# EAGLE design current-sense-v1.0 (EAGLE 9.5.2)

## Sheet 1 of 3: Motor Driver
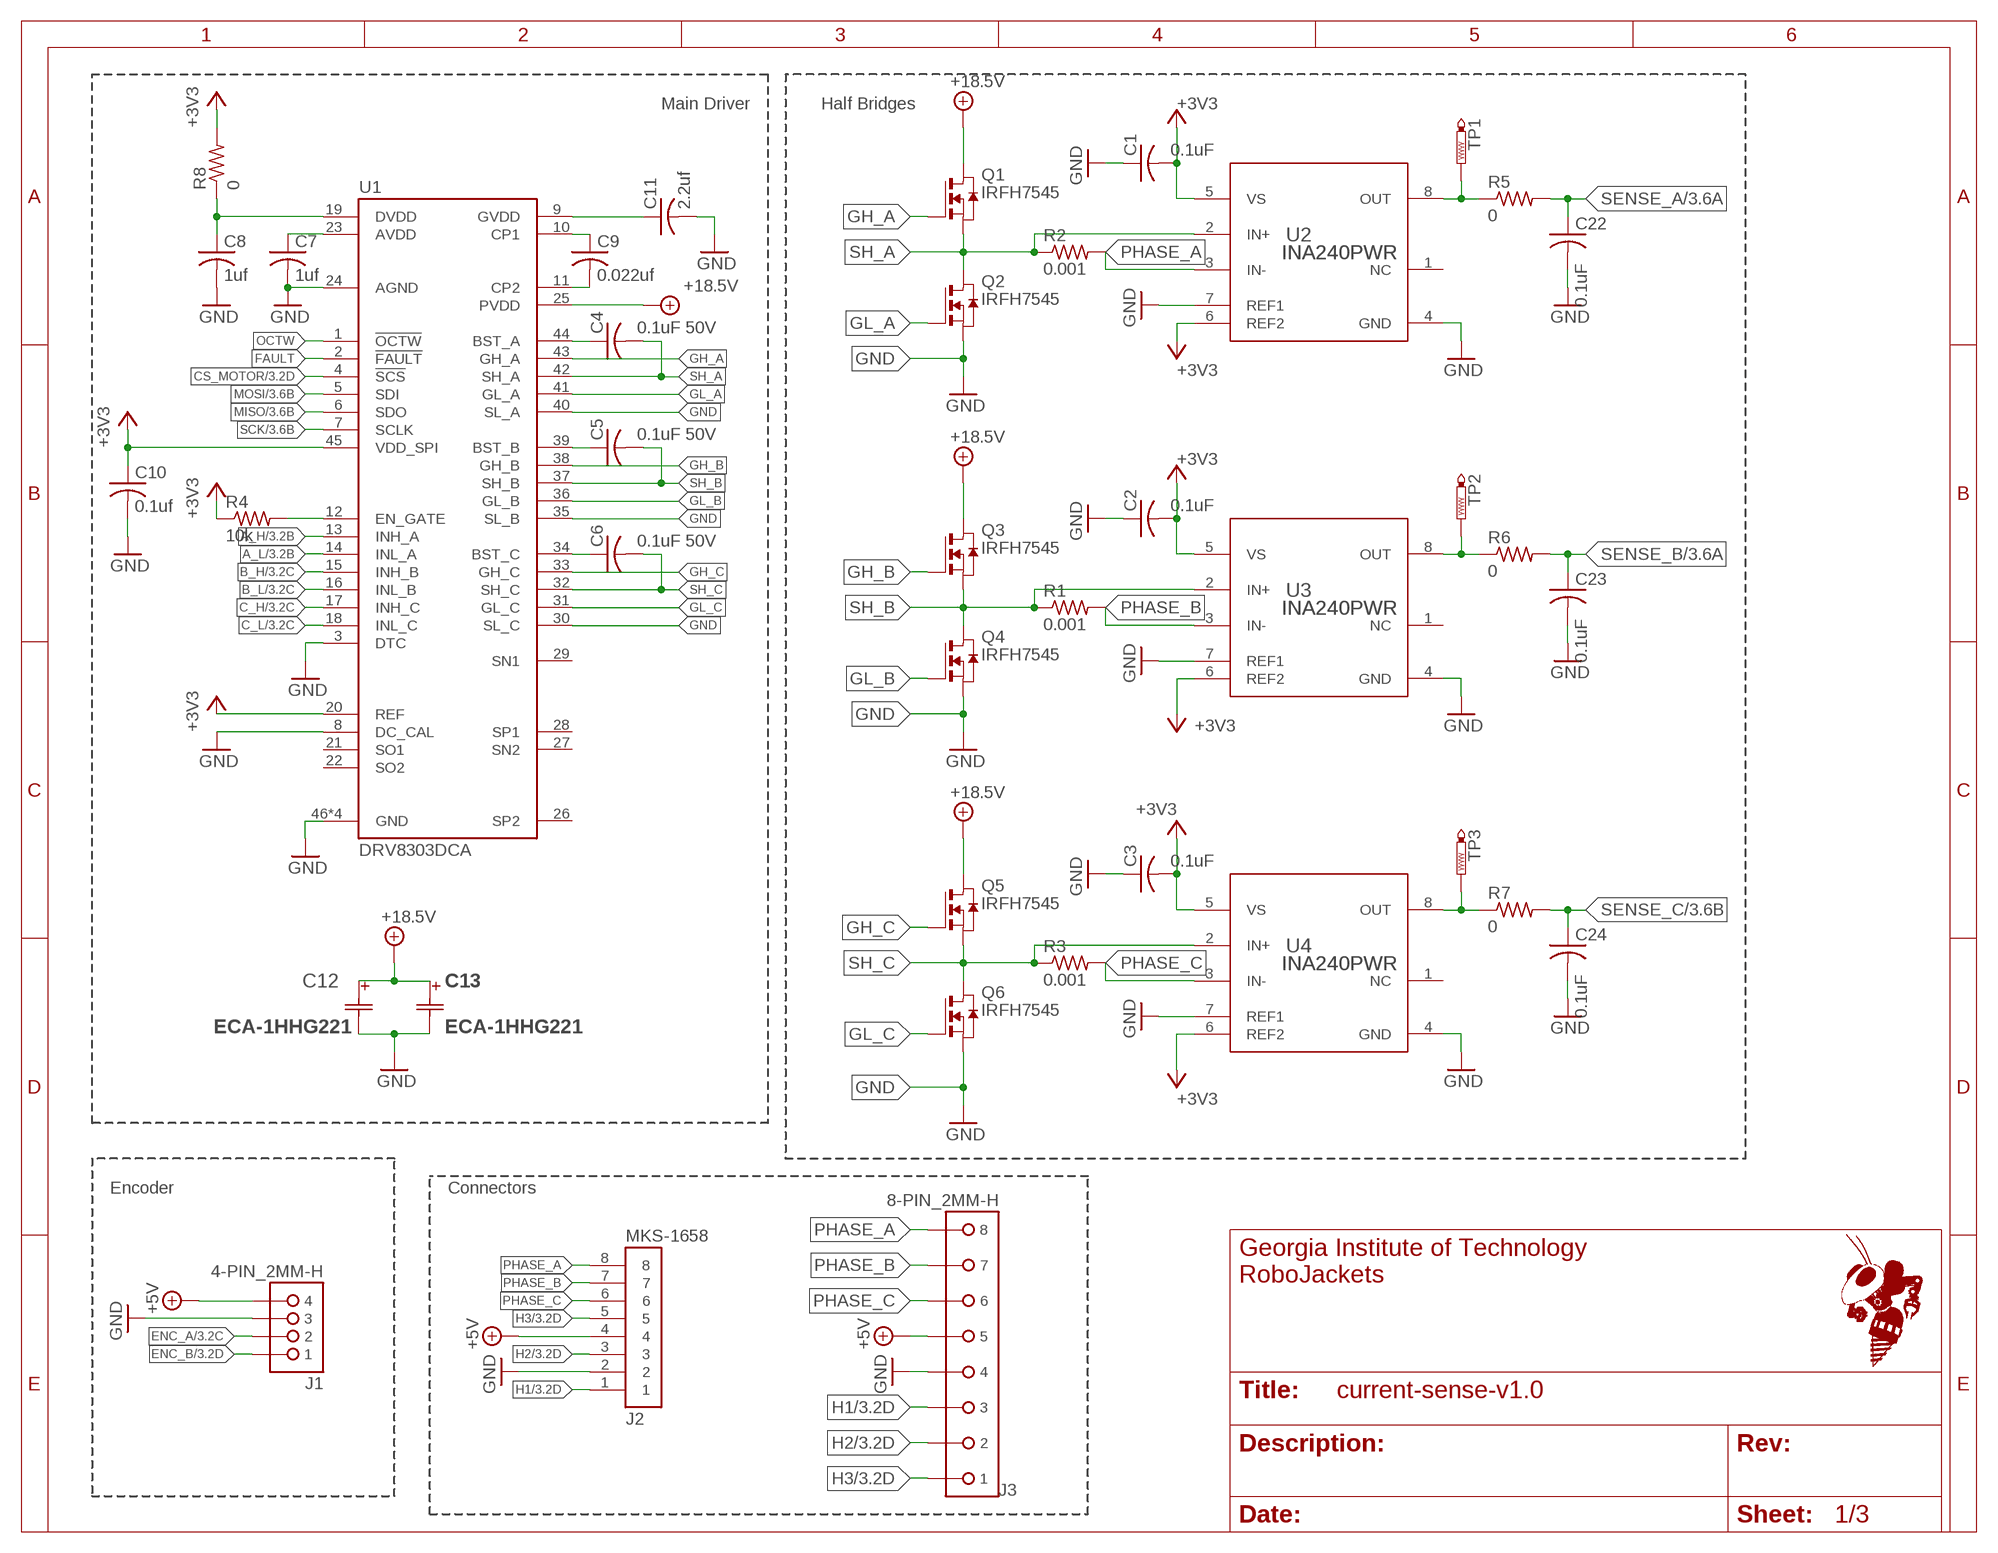
[diagram p0: schematic, sheet 1]

### Parts
C1  0.1uF  C-USC0603  [C0603]
C2  0.1uF  C-USC0603  [C0603]
C3  0.1uF  C-USC0603  [C0603]
C4  0.1uF 50V  C-USC0603  [C0603]
C5  0.1uF 50V  C-USC0603  [C0603]
C6  0.1uF 50V  C-USC0603  [C0603]
C7  1uf  C-USC0603  [C0603]
C8  1uf  C-USC0603  [C0603]
C9  0.022uf  C-USC0603  [C0603]
C10  0.1uf  C-USC0603  [C0603]
C11  2.2uf  C-USC0603  [C0603]
C12  ECA-1HHG221  [CAP_PAN_10X12.5]
C13  ECA-1HHG221  [CAP_PAN_10X12.5]
C22  0.1uF  C-USC0603  [C0603]
C23  0.1uF  C-USC0603  [C0603]
C24  0.1uF  C-USC0603  [C0603]
J1  4-PIN_2MM-H  [2MM-4-H]
J2  MKS-1658  [MKS-1658]
J3  8-PIN_2MM-H  [2MM-8-H]
Q1  IRFH7545  [PQFN_5X6_E]
Q2  IRFH7545  [PQFN_5X6_E]
Q3  IRFH7545  [PQFN_5X6_E]
Q4  IRFH7545  [PQFN_5X6_E]
Q5  IRFH7545  [PQFN_5X6_E]
Q6  IRFH7545  [PQFN_5X6_E]
R1  0.001  R-US_R2512  [R2512]
R2  0.001  R-US_R2512  [R2512]
R3  0.001  R-US_R2512  [R2512]
R4  10k  R-US_R0603  [R0603]
R5  0  R-US_R0603  [R0603]
R6  0  R-US_R0603  [R0603]
R7  0  R-US_R0603  [R0603]
R8  0  R-US_R0603  [R0603]
TP1  PTR1PAD1-13  [P1-13]
TP2  PTR1PAD1-13  [P1-13]
TP3  PTR1PAD1-13  [P1-13]
U1  DRV8303DCA  [TSSOP-48_PAD]
U2  INA240PWR  [PW0008A_N]
U3  INA240PWR  [PW0008A_N]
U4  INA240PWR  [PW0008A_N]

### Nets
+3V3: C1.2 C2.2 C3.2 C10.1 R4.1 R8.2 U1.20(REF) U1.45(VDD_SPI) U2.5(VS) U2.6(REF2) U3.5(VS) U3.6(REF2) U4.5(VS) U4.6(REF2) ; also sheet 2,3
+5V: J1.4 J2.4 J3.5 ; also sheet 2
+18.5V: C12.1 C13.1 Q1.5678(D) Q3.5678(D) Q5.5678(D) U1.25(PVDD) ; also sheet 2
A_H: U1.13(INH_A) ; also sheet 3
A_L: U1.14(INL_A) ; also sheet 3
AVDD: C7.1 U1.23(AVDD)
B_H: U1.15(INH_B) ; also sheet 3
B_L: U1.16(INL_B) ; also sheet 3
BST_A: C4.1 U1.44(BST_A)
BST_B: C5.1 U1.39(BST_B)
BST_C: C6.1 U1.34(BST_C)
C_H: U1.17(INH_C) ; also sheet 3
C_L: U1.18(INL_C) ; also sheet 3
CP1: C9.1 U1.10(CP1)
CP2: C9.2 U1.11(CP2)
CS_MOTOR: U1.4(!SCS) ; also sheet 3
DVDD: C8.1 R8.1 U1.19(DVDD)
EN_GATE: R4.2 U1.12(EN_GATE)
ENC_A: J1.2 ; also sheet 3
ENC_B: J1.1 ; also sheet 3
FAULT: U1.2(!FAULT)
GH_A: Q1.4(G) U1.43(GH_A)
GH_B: Q3.4(G) U1.38(GH_B)
GH_C: Q5.4(G) U1.33(GH_C)
GL_A: Q2.4(G) U1.41(GL_A)
GL_B: Q4.4(G) U1.36(GL_B)
GL_C: Q6.4(G) U1.31(GL_C)
GND: C1.1 C2.1 C3.1 C7.2 C8.2 C10.2 C11.2 C12.2 C13.2 C22.2 C23.2 C24.2 J1.3 J2.2 J3.4 Q2.1(S) Q2.2(S) Q2.3(S) Q4.1(S) Q4.2(S) Q4.3(S) Q6.1(S) Q6.2(S) Q6.3(S) U1.3(DTC) U1.8(DC_CAL) U1.24(AGND) U1.30(SL_C) U1.35(SL_B) U1.40(SL_A) U1.46(GND) U1.47(GND) U1.48(GND) U1.PAD(GND) U2.4(GND) U2.7(REF1) U3.4(GND) U3.7(REF1) U4.4(GND) U4.7(REF1) ; also sheet 2,3
GVDD: C11.1 U1.9(GVDD)
H1: J2.1 J3.3 ; also sheet 3
H2: J2.3 J3.2 ; also sheet 3
H3: J2.5 J3.1 ; also sheet 3
MISO: U1.6(SDO) ; also sheet 3
MOSI: U1.5(SDI) ; also sheet 3
OCTW: U1.1(!OCTW)
OUT_A: R5.1 TP1.TP U2.8(OUT)
OUT_B: R6.1 TP2.TP U3.8(OUT)
OUT_C: R7.1 TP3.TP U4.8(OUT)
PHASE_A: J2.8 J3.8 R2.2 U2.3(IN-)
PHASE_B: J2.7 J3.7 R1.2 U3.3(IN-)
PHASE_C: J2.6 J3.6 R3.2 U4.3(IN-)
SCK: U1.7(SCLK) ; also sheet 3
SENSE_A: C22.1 R5.2 ; also sheet 3
SENSE_B: C23.1 R6.2 ; also sheet 3
SENSE_C: C24.1 R7.2 ; also sheet 3
SH_A: C4.2 Q1.1(S) Q1.2(S) Q1.3(S) Q2.5678(D) R2.1 U1.42(SH_A) U2.2(IN+)
SH_B: C5.2 Q3.1(S) Q3.2(S) Q3.3(S) Q4.5678(D) R1.1 U1.37(SH_B) U3.2(IN+)
SH_C: C6.2 Q5.1(S) Q5.2(S) Q5.3(S) Q6.5678(D) R3.1 U1.32(SH_C) U4.2(IN+)
Unconnected: U1.21(SO1) U1.22(SO2) U1.26(SP2) U1.27(SN2) U1.28(SP1) U1.29(SN1) U2.1(NC) U3.1(NC) U4.1(NC)

### Notes on the sheet
- Main Driver | Half Bridges
- Encoder | Connectors

## Sheet 2 of 3: Power
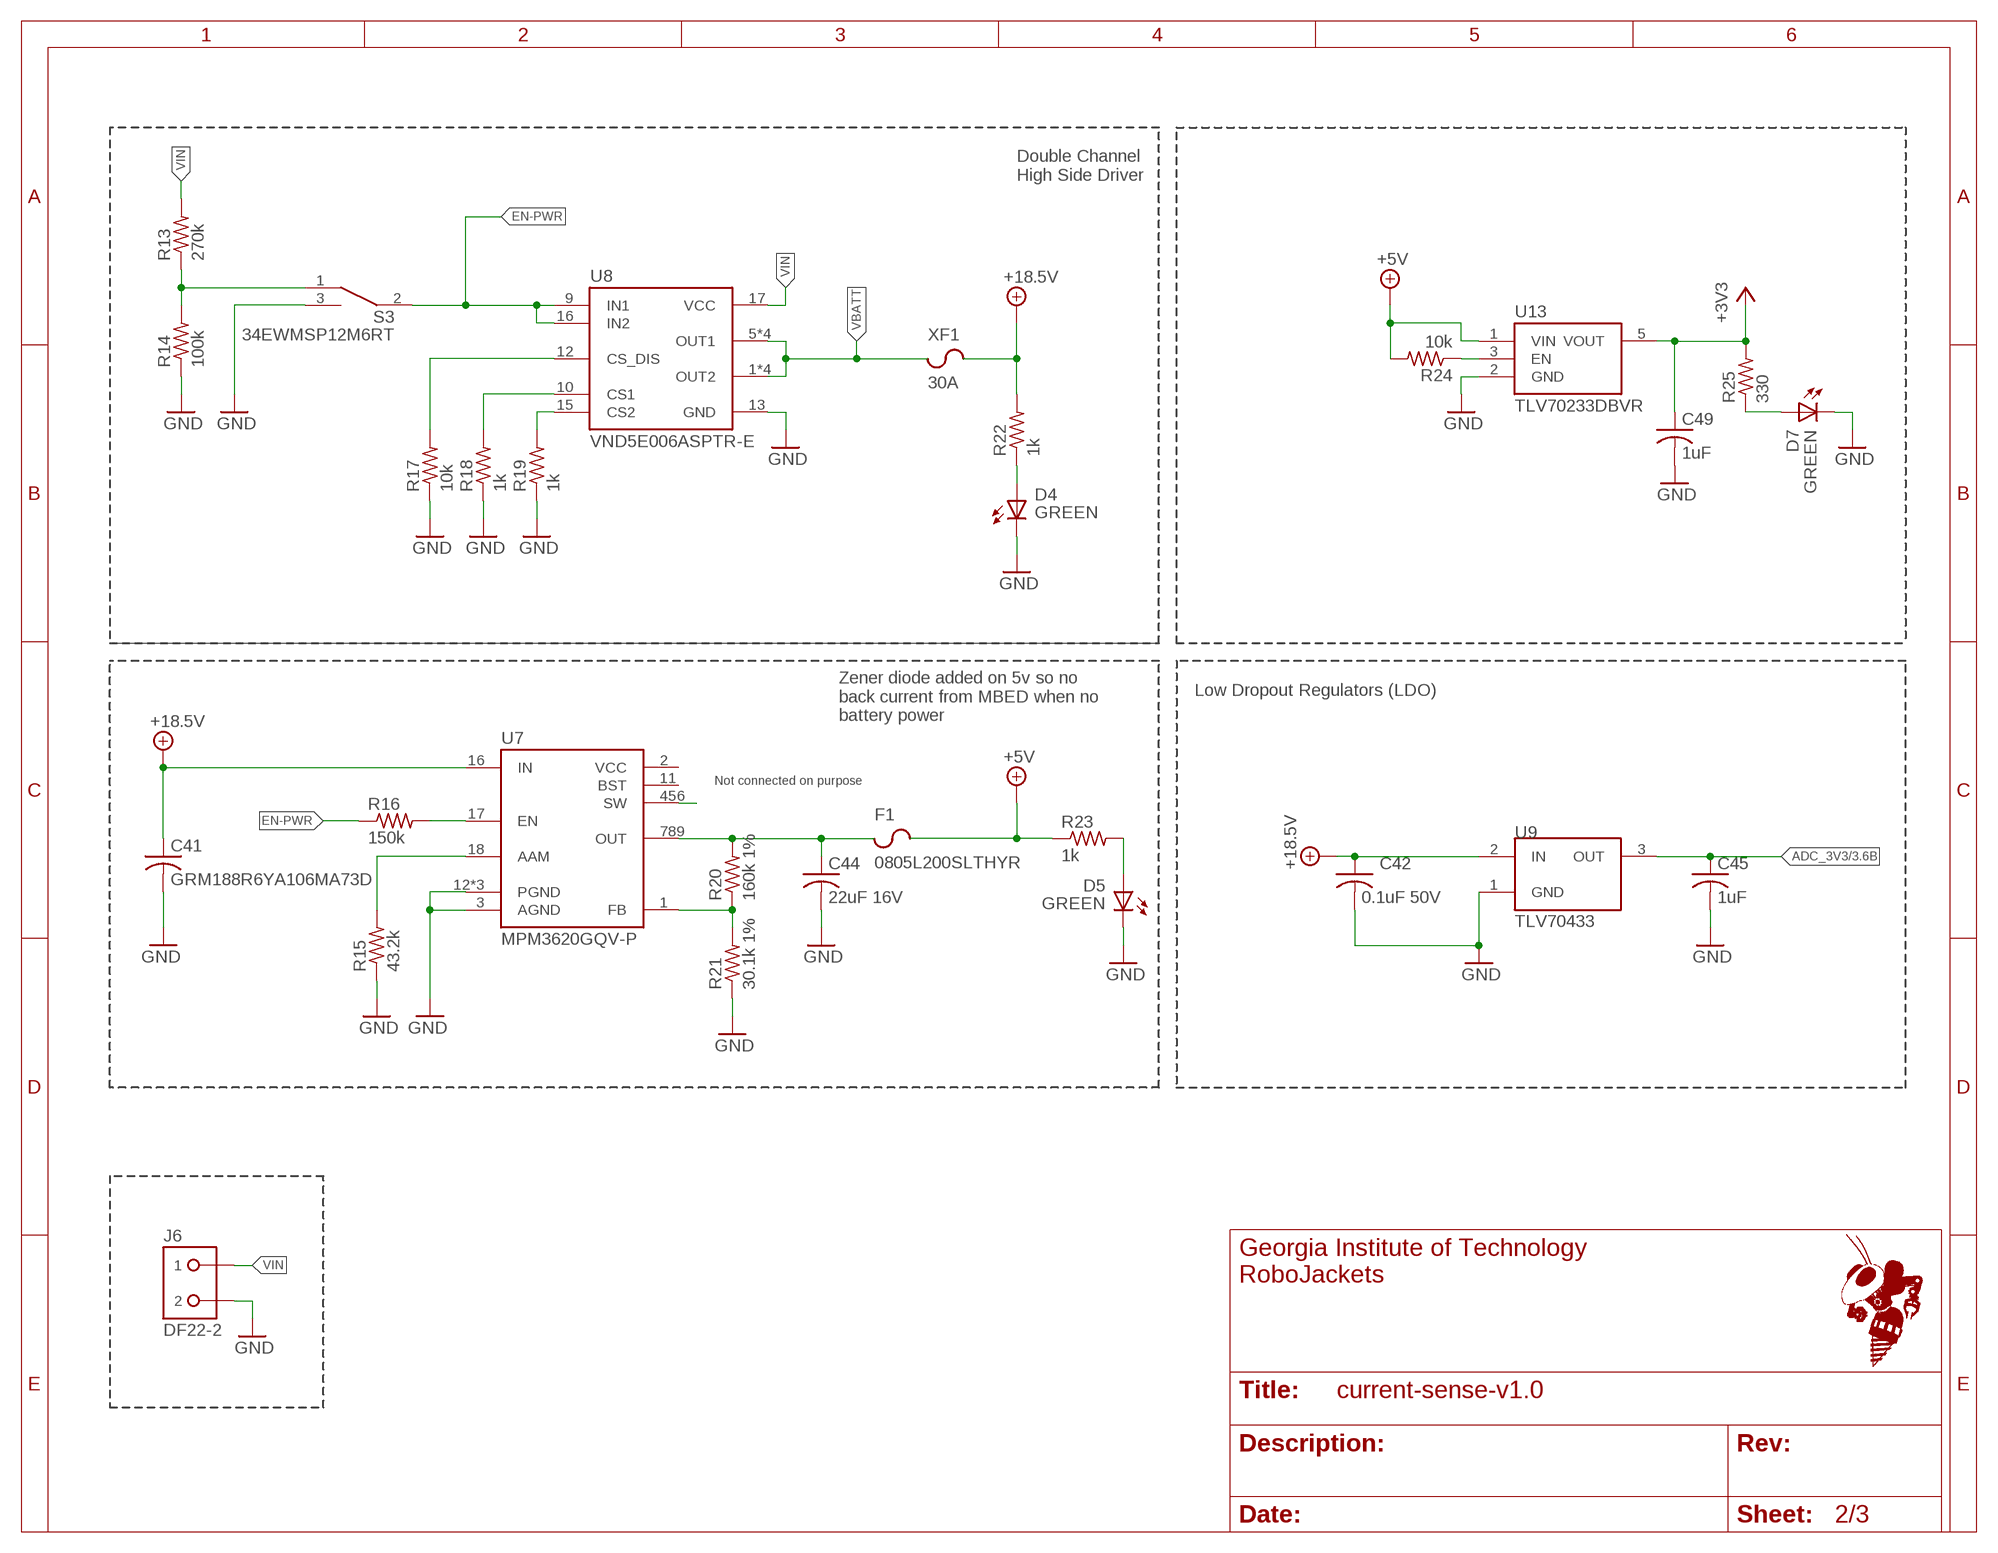
[diagram p1: schematic, sheet 2]

### Parts
C41  GRM188R6YA106MA73D  C-USC0603  [C0603]
C42  0.1uF 50V  C-USC0603  [C0603]
C44  22uF 16V  C-USC0805  [C0805]
C45  1uF  C-USC0603  [C0603]
C49  1uF  C-USC0603  [C0603]
D4  GREEN  LED-SMD-GREEN  [CHIP-LED0603]
D5  GREEN  LED-SMD-GREEN  [CHIP-LED0603]
D7  GREEN  LED-SMD-GREEN  [CHIP-LED0603]
F1  0805L200SLTHYR  CHIP_FUSE0805  [FUSC2113X75]
J6  DF22-2  [DF22-2-H]
R13  270k  R-US_R0603  [R0603]
R14  100k  R-US_R0603  [R0603]
R15  43.2k  R-US_R0603  [R0603]
R16  150k  R-US_R0603  [R0603]
R17  10k  R-US_R0603  [R0603]
R18  1k  R-US_R0603  [R0603]
R19  1k  R-US_R0603  [R0603]
R20  160k 1%  R-US_R0603  [R0603]
R21  30.1k 1%  R-US_R0603  [R0603]
R22  1k  R-US_R0603  [R0603]
R23  1k  R-US_R0603  [R0603]
R24  10k  R-US_R0603  [R0603]
R25  330  R-US_R0603  [R0603]
S3  34EWMSP12M6RT  [34EWMSP12M6RT]
U7  MPM3620GQV-P  [MPM3620GQV-P]
U8  VND5E006ASPTR-E  [POWERSO-16]
U9  TLV70433  [SOT-23-5]
U13  TLV70233DBVR  [SOT-23-5]
XF1  30A  3557-2  [3557-2]

### Nets
3.3V-EN: R24.1 U13.3(EN)
3V3-LED: D7.A R25.1
5V-LED: D5.A R23.2
18.5V-LED: D4.A R22.1
+3V3: C49.1 R25.2 U13.5(VOUT) ; also sheet 1,3
+5V: F1.2 R23.1 R24.2 U13.1(VIN) ; also sheet 1
+5V-FUSE: C44.1 F1.1 R20.2 U7.789(OUT)
+18.5V: C41.1 C42.1 R22.2 U7.16(IN) U9.2(IN) XF1.3 XF1.4 ; also sheet 1
AAM: R15.2 U7.18(AAM)
ADC_3V3: C45.1 U9.3(OUT) ; also sheet 3
CS1: R18.2 U8.10(CS1)
CS2: R19.2 U8.15(CS2)
CS-DIS: R17.2 U8.12(CS_DIS)
EN: R16.2 U7.17(EN)
EN-PWR: R16.1 S3.2(COMMON) U8.9(IN1) U8.16(IN2)
EN-PWR-PRE: R13.1 R14.2 S3.1(A)
FB: R20.1 R21.2 U7.1(FB)
GND: C41.2 C42.2 C44.2 C45.2 C49.2 D4.C(K) D5.C(K) D7.C(K) J6.2 R14.1 R15.1 R17.1 R18.1 R19.1 R21.1 S3.3(B) U7.3(AGND) U7.12(PGND) U7.13(PGND) U7.14(PGND) U8.13(GND) U9.1(GND) U13.2(GND) ; also sheet 1,3
SW: U7.456(SW)
VBATT: U8.1(OUT2) U8.2(OUT2) U8.3(OUT2) U8.4(OUT2) U8.5(OUT1) U8.6(OUT1) U8.7(OUT1) U8.8(OUT1) XF1.1 XF1.2
VIN: J6.1 R13.2 U8.17(VCC)
Unconnected: S3.LEG1 S3.LEG3(LEG2) U7.2(VCC) U7.11(BST)

### Notes on the sheet
- Double Channel 
  High Side Driver
- Low Dropout Regulators (LDO)
- Zener diode added on 5v so no
  back current from MBED when no
  battery power
- Not connected on purpose

## Sheet 3 of 3: FPGA Interface
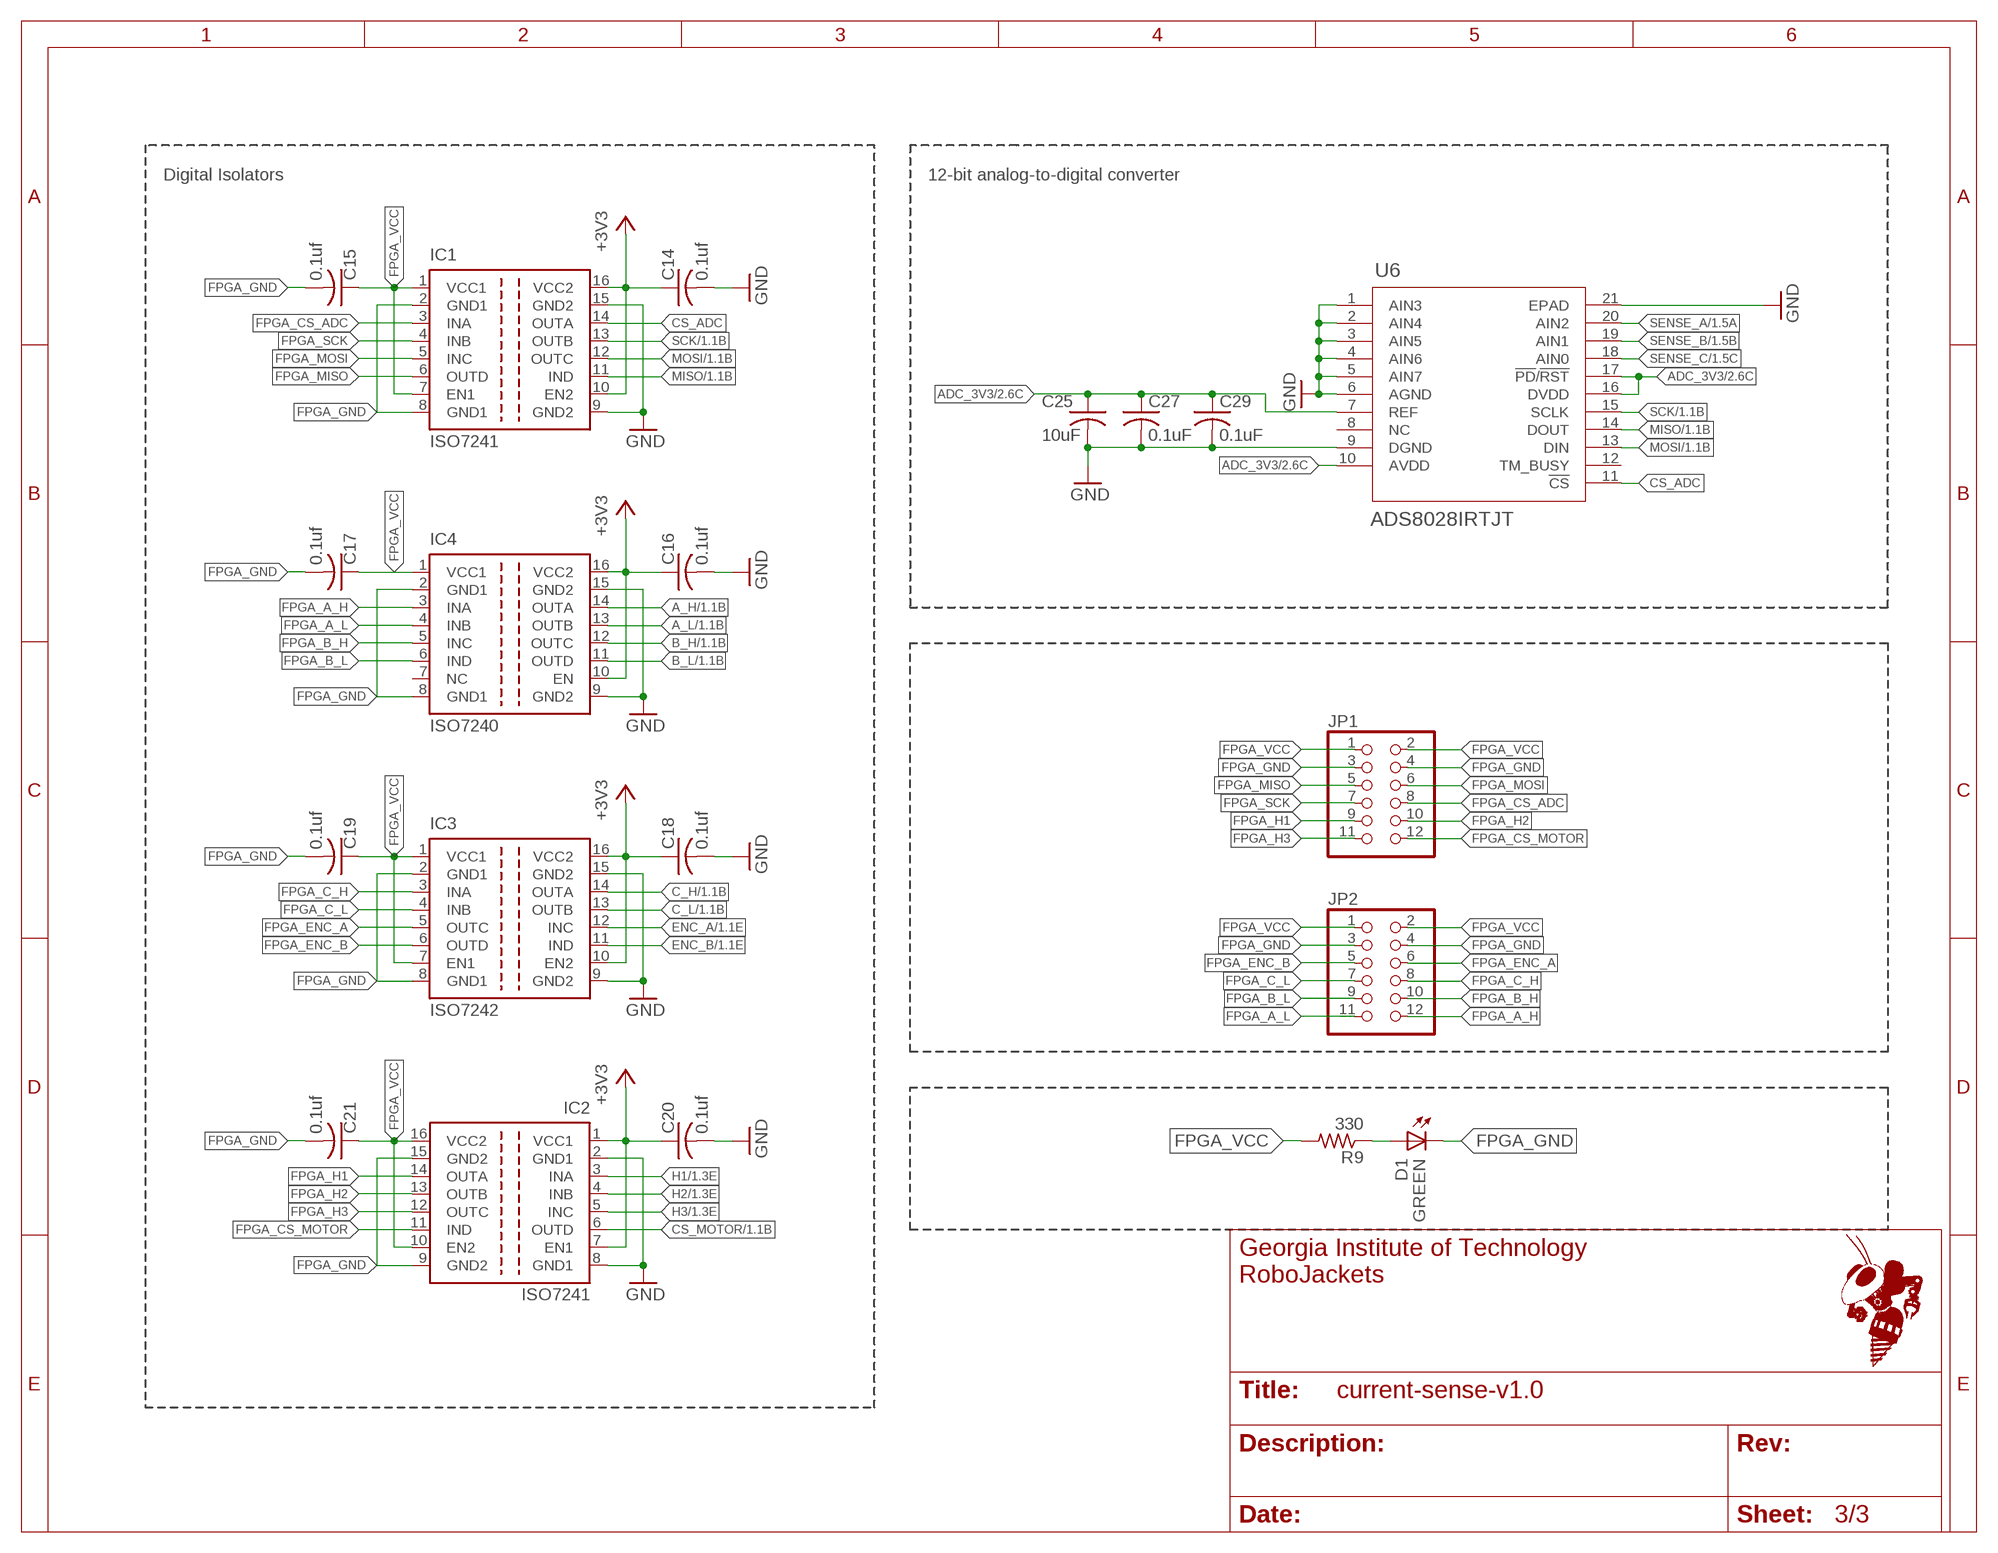
[diagram p2: schematic, sheet 3]

### Parts
C14  0.1uf  C-USC0603  [C0603]
C15  0.1uf  C-USC0603  [C0603]
C16  0.1uf  C-USC0603  [C0603]
C17  0.1uf  C-USC0603  [C0603]
C18  0.1uf  C-USC0603  [C0603]
C19  0.1uf  C-USC0603  [C0603]
C20  0.1uf  C-USC0603  [C0603]
C21  0.1uf  C-USC0603  [C0603]
C25  10uF  C-USC0603  [C0603]
C27  0.1uF  C-USC0603  [C0603]
C29  0.1uF  C-USC0603  [C0603]
D1  GREEN  LED-SMD-GREEN  [CHIP-LED0603]
IC1  ISO7241  [SO-16DW]
IC2  ISO7241  [SO-16DW]
IC3  ISO7242  [SO-16DW]
IC4  ISO7240  [SO-16DW]
JP1  PINHD-2X6/90  [2X06/90]
JP2  PINHD-2X6/90  [2X06/90]
R9  330  R-US_R0603  [R0603]
U6  ADS8028IRTJT  [RTJ20_2P7X2P7]

### Nets
+3V3: C14.1 C16.1 C18.1 C20.1 IC1.10(EN2) IC1.16(VCC2) IC2.1(VCC1) IC2.7(EN1) IC3.10(EN2) IC3.16(VCC2) IC4.10(EN) IC4.16(VCC2) ; also sheet 1,2
A_H: IC4.14(OUTA) ; also sheet 1
A_L: IC4.13(OUTB) ; also sheet 1
ADC_3V3: C25.1 C27.1 C29.1 U6.7(REF) U6.10(AVDD) U6.16(DVDD) U6.17(!PD!/!RST!) ; also sheet 2
B_H: IC4.12(OUTC) ; also sheet 1
B_L: IC4.11(OUTD) ; also sheet 1
C_H: IC3.14(OUTA) ; also sheet 1
C_L: IC3.13(OUTB) ; also sheet 1
CS_ADC: IC1.14(OUTA) U6.11(!CS)
CS_MOTOR: IC2.6(OUTD) ; also sheet 1
ENC_A: IC3.12(INC) ; also sheet 1
ENC_B: IC3.11(IND) ; also sheet 1
FPGA_A_H: IC4.3(INA) JP2.12
FPGA_A_L: IC4.4(INB) JP2.11
FPGA_B_H: IC4.5(INC) JP2.10
FPGA_B_L: IC4.6(IND) JP2.9
FPGA_C_H: IC3.3(INA) JP2.8
FPGA_C_L: IC3.4(INB) JP2.7
FPGA_CS_ADC: IC1.3(INA) JP1.8
FPGA_CS_MOTOR: IC2.11(IND) JP1.12
FPGA_ENC_A: IC3.5(OUTC) JP2.6
FPGA_ENC_B: IC3.6(OUTD) JP2.5
FPGA_GND: C15.2 C17.2 C19.2 C21.2 D1.C(K) IC1.2(GND1) IC1.8(GND1) IC2.9(GND2) IC2.15(GND2) IC3.2(GND1) IC3.8(GND1) IC4.2(GND1) IC4.8(GND1) JP1.3 JP1.4 JP2.3 JP2.4
FPGA_H1: IC2.14(OUTA) JP1.9
FPGA_H2: IC2.13(OUTB) JP1.10
FPGA_H3: IC2.12(OUTC) JP1.11
FPGA_MISO: IC1.6(OUTD) JP1.5
FPGA_MOSI: IC1.5(INC) JP1.6
FPGA_SCK: IC1.4(INB) JP1.7
FPGA_VCC: C15.1 C17.1 C19.1 C21.1 IC1.1(VCC1) IC1.7(EN1) IC2.10(EN2) IC2.16(VCC2) IC3.1(VCC1) IC3.7(EN1) IC4.1(VCC1) JP1.1 JP1.2 JP2.1 JP2.2 R9.2
GND: C14.2 C16.2 C18.2 C20.2 C25.2 C27.2 C29.2 IC1.9(GND2) IC1.15(GND2) IC2.2(GND1) IC2.8(GND1) IC3.9(GND2) IC3.15(GND2) IC4.9(GND2) IC4.15(GND2) U6.1(AIN3) U6.2(AIN4) U6.3(AIN5) U6.4(AIN6) U6.5(AIN7) U6.6(AGND) U6.9(DGND) U6.21(EPAD) ; also sheet 1,2
H1: IC2.3(INA) ; also sheet 1
H2: IC2.4(INB) ; also sheet 1
H3: IC2.5(INC) ; also sheet 1
MISO: IC1.11(IND) U6.14(DOUT) ; also sheet 1
MOSI: IC1.12(OUTC) U6.13(DIN) ; also sheet 1
N$1: D1.A R9.1
SCK: IC1.13(OUTB) U6.15(SCLK) ; also sheet 1
SENSE_A: U6.20(AIN2) ; also sheet 1
SENSE_B: U6.19(AIN1) ; also sheet 1
SENSE_C: U6.18(AIN0) ; also sheet 1
Unconnected: IC4.7(NC) U6.8(NC) U6.12(TM_BUSY)

### Notes on the sheet
- Digital Isolators | 12-bit analog-to-digital converter

## Library data of the parts
C1-C11 C14-C25 C27 C29 C42 C44 C45 = rcl:C-US: CAPACITOR, American symbol; SPICEPREFIX: C
C12 C13 = RoboJackets-Capacitors:ECA-1HHG221; DIGIKEY: P5572-ND; MANUFACTURER_PART_NUMBER: ECA-1HHG221
C41 C49 = rcl:C-US: CAPACITOR, American symbol
D1 D4 D5 D7 = RoboJackets-LEDs:LED-SMD; DIGIKEY: 160-1446-1-ND; MPN: LTST-C191KGKT
F1 = RoboJackets-Fuses:CHIP_FUSE
IC1 IC2 = texas:ISO7241: HIGH SPEED QUAD DIGITAL ISOLATORS Source: http://focus.ti.com/lit/ds/symlink/iso7240m.pdf; MPN: ISO7241CDW; OC_FARNELL: 1575372; OC_NEWARK: 73M3155
IC3 = texas:ISO7242: HIGH SPEED QUAD DIGITAL ISOLATORS Source: http://focus.ti.com/lit/ds/symlink/iso7240m.pdf; MPN: ISO7242MDW; OC_FARNELL: 1755127; OC_NEWARK: 73M3163
IC4 = texas:ISO7240: HIGH SPEED QUAD DIGITAL ISOLATORS Source: http://focus.ti.com/lit/ds/symlink/iso7240m.pdf; MPN: ISO7240MDW; OC_FARNELL: 1755124; OC_NEWARK: 58M0385
J1 = RoboJackets-Connectors:4-PIN_2MM-*: MPN: 0353630460; DIGIKEY: WM18933-ND; MPN: 0353630460
J2 = RoboJackets-Connectors:MKS-1658; MPN: MKS 1658-6-0-808
J3 = RoboJackets-Connectors:8-PIN_2MM-*; DIGIKEY: WM18937-ND; MPN: 0353630860
J6 = RoboJackets-Connectors:DF22-2; DIGIKEY: H125155-ND; MPN: DF22-2P-7.92DS(35)
JP1 JP2 = pinhead:PINHD-2X6: PIN HEADER
Q1-Q6 = RoboJackets-Discrete:IRFH7545; DIGIKEY: IRFH7545TRPBFCT-ND; MPN: IRFH7545TRPBF
R1-R8 R15 R16 R20 R21 = rcl:R-US_: RESISTOR, American symbol; SPICEPREFIX: R
R9 R23 R25 = resistor:R-US_: RESISTOR, American symbol
R13 R14 R17-R19 R22 R24 = rcl:R-US_: RESISTOR, American symbol
S3 = RoboJackets-Switches:34EWMSP12M6RT; DIGIKEY: GH7540CT-ND; MPN: 34EWMSP12M6RT
TP1-TP3 = testpad:PTR1: TEST PIN
U1 = RoboJackets-PowerICs:DRV8303; DIGIKEY: 296-40070-1-ND; MPN: DRV8303DCAR
U2-U4 = RoboJackets-ICs:INA240PWR
U6 = RoboJackets-ICs:ADS8028IRTJT; DIGIKEY: 296-30382-2-ND; MANUFACTURER_PART_NUMBER: ADS8028IRTJT; VENDOR: Texas Instruments
U7 = RoboJackets-PowerICs:MPM3620GQV-P; DIGIKEY: 1589-1252-1-ND; MPN: MPM3620GQV-P
U8 = RoboJackets-PowerICs:VND5E006ASPTR-E; DIGIKEY: 497-11623-1-ND; MPN: VND5E006ASPTR-E
U9 = RoboJackets-PowerICs:TLV70433
U13 = RoboJackets-PowerICs:TLV70233; DIGIKEY: 296-32415-1-ND; MPN: TLV70233DBVR
XF1 = RoboJackets-Fuses:3557-2; DIGIKEY: 36-3557-2-ND; MPN: 3557-2

## Board
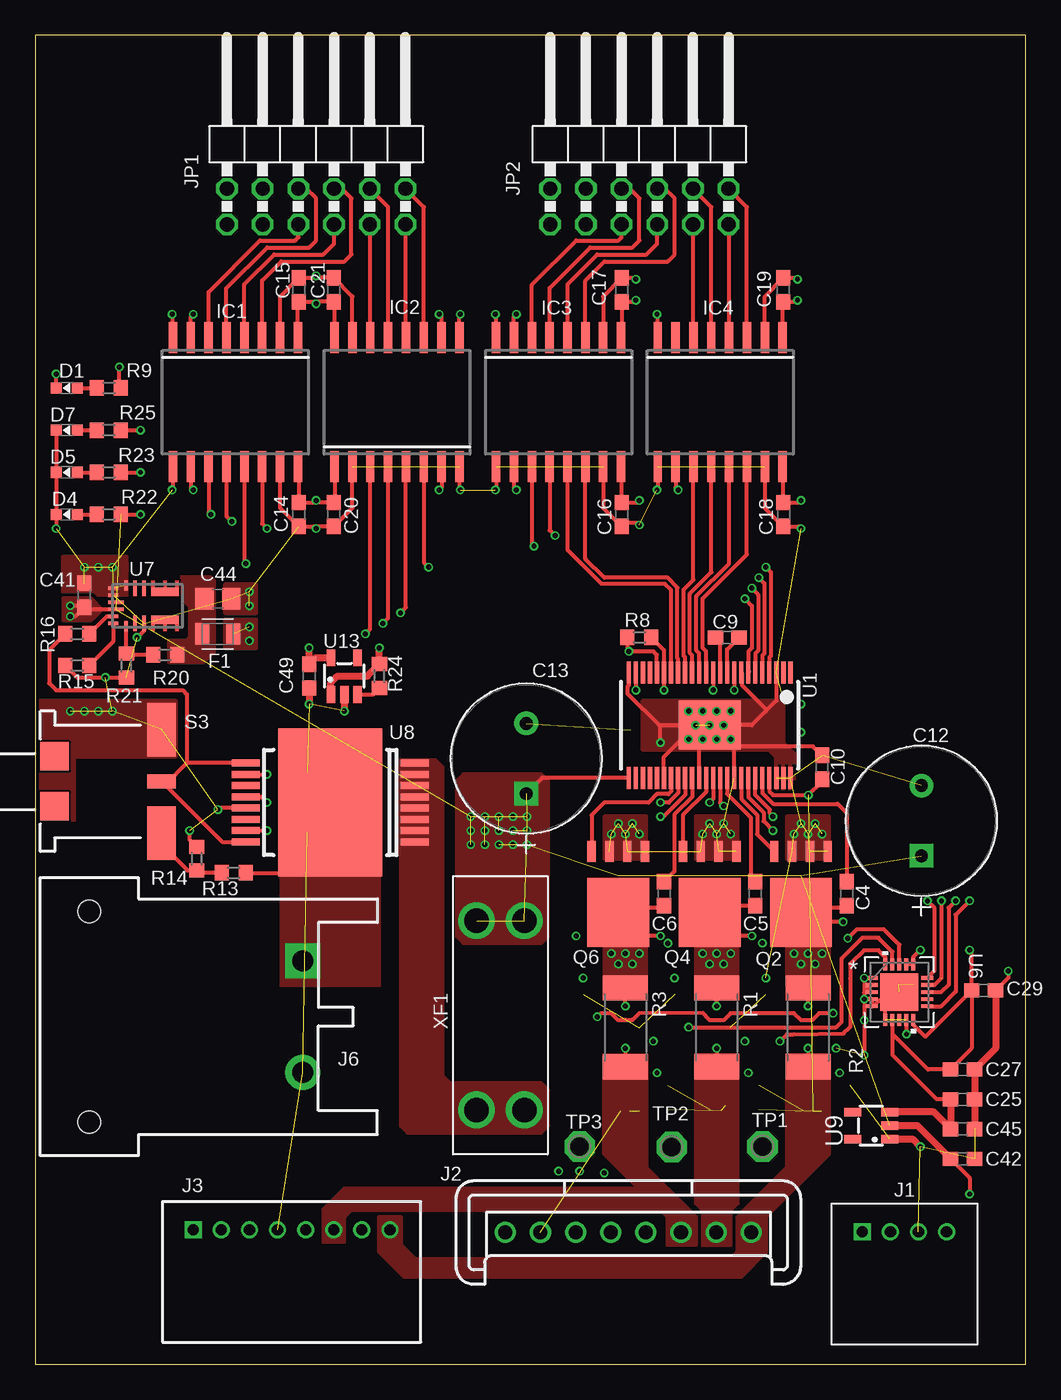
[diagram p3: board, top side]
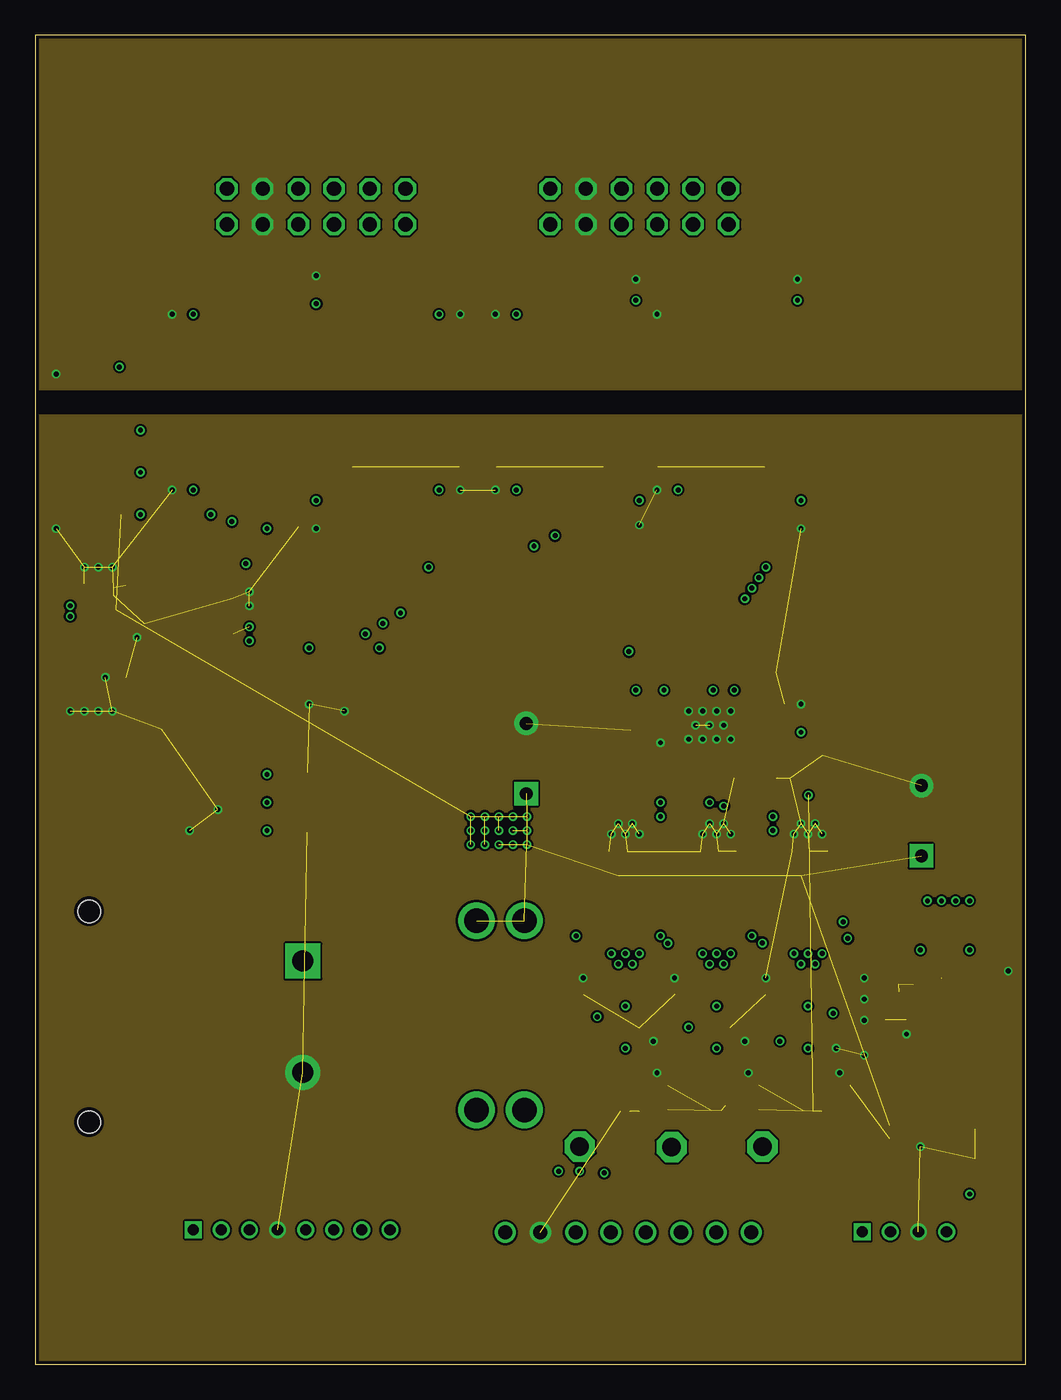
[diagram p4: board, inner layer GND]
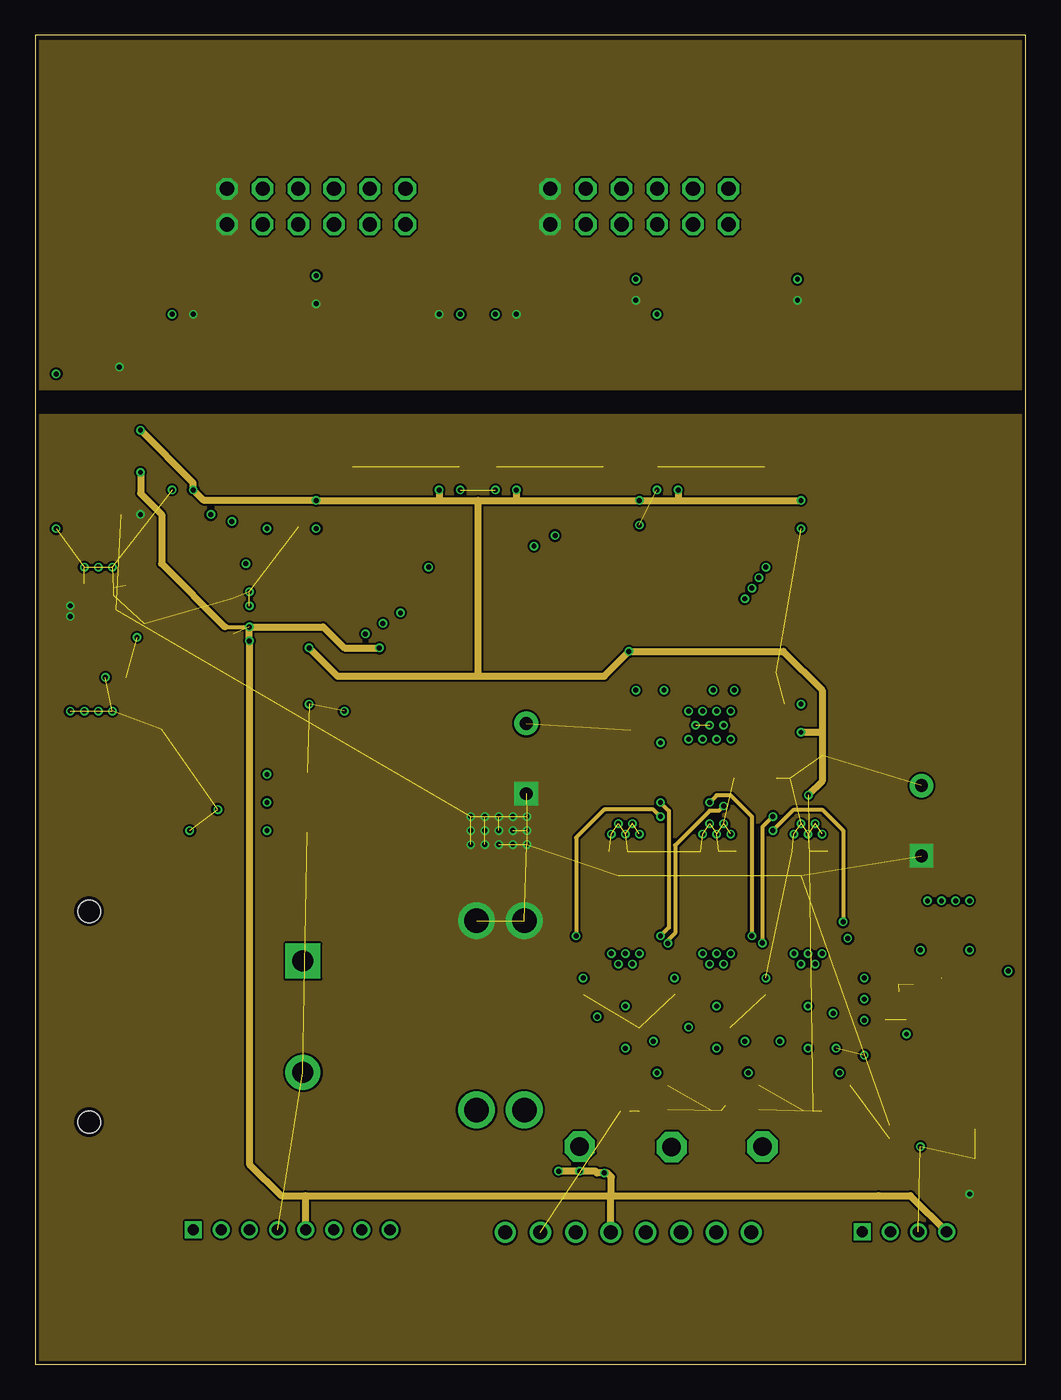
[diagram p5: board, inner layer Power]
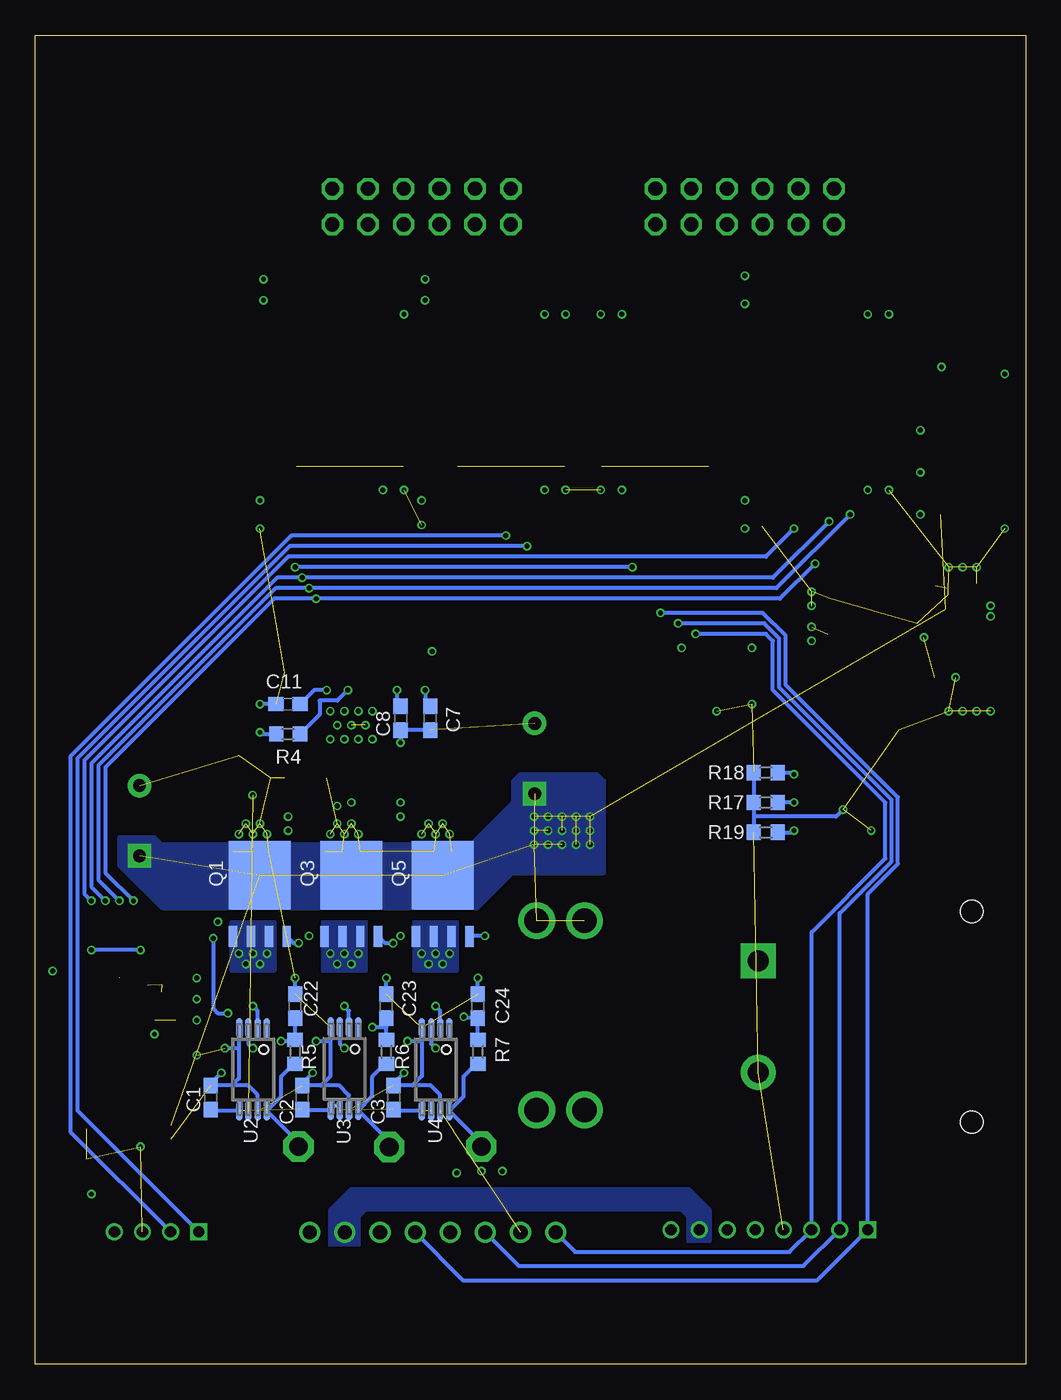
[diagram p6: board, bottom side, seen from below]

Size 70.5 x 94.62 mm. Coordinates in mm from the lower left corner, seen from the top.
Outline: 0,0 70.5,0 70.5,94.62 0,94.62 0,0
Copper layers (1+2*3+16): Top 0.018mm / dielectric 0.36mm / GND 0.035mm / dielectric 0.71mm / Power 0.035mm / dielectric 0.36mm / Bottom 0.018mm
Design rules "eC_4Layer_PClass6_BaseCopperO18-I35_eCDefault": minimum track width 0.15mm, minimum drill 0.35mm, track to track 0.15mm, track to pad 0.15mm, pad to pad 0.15mm, via to via 0.15mm, smd to smd 0mil, copper to edge 0.25mm, drill to drill 0.35mm, minimum pad ring 0.175mm, minimum via ring 0.125mm, stop-mask expansion 0mil, vias tented up to drill 0.45mm, thermal gap 0.2mm

### Footprints (pad centres in the part's own frame; a part is rotated, then mirrored left to right if it is on the bottom)
C0603 = smd 1.1 x 1: 1 -0.85,0; 2 0.85,0
CAP_PAN_10X12.5 = drill 0.914 pad 1.676 square: 1 -5.004,0 | drill 0.914 pad 1.676: 2 0,0
C0805 = smd 1.3 x 1.5: 1 -0.95,0; 2 0.95,0
CHIP-LED0603 = smd 0.8 x 0.8: A 0,-0.75; C 0,0.75
FUSC2113X75 = smd 1 x 1.52: 1 -1.1,0 | smd 1 x 1.5: 2 1.1,0
SO-16DW = smd 0.6 x 2.2: 1 -4.445,-4.6; 2 -3.175,-4.6; 3 -1.905,-4.6; 4 -0.635,-4.6; 5 0.635,-4.6; 6 1.905,-4.6; 7 3.175,-4.6; 8 4.445,-4.6; 9 4.445,4.6; 10 3.175,4.6; 11 1.905,4.6; 12 0.635,4.6; 13 -0.635,4.6; 14 -1.905,4.6; 15 -3.175,4.6; 16 -4.445,4.6
2MM-4-H = drill 0.8 square: 1 -3,0 | drill 0.8: 2 -1,0; 3 1,0; 4 3,0
MKS-1658 = drill 1 pad 1.422: 1 -8.75,0; 2 -6.25,0; 3 -3.75,0; 4 -1.25,0; 5 1.25,0; 6 3.75,0; 7 6.25,0; 8 8.75,0
2MM-8-H = drill 0.8 square: 1 -7,0 | drill 0.8: 2 -5,0; 3 -3,0; 4 -1,0; 5 1,0; 6 3,0; 7 5,0; 8 7,0
DF22-2-H = drill 1.5 pad 2.5 square: 1 3.96,0 | drill 1.5 pad 2.5: 2 -3.96,0 | hole 1.6: -7.5,15.2; 7.5,15.2
2X06/90 = drill 1.016 octagon: 1 -6.35,-6.35; 2 -6.35,-3.81; 3 -3.81,-6.35; 4 -3.81,-3.81; 5 -1.27,-6.35; 6 -1.27,-3.81; 7 1.27,-6.35; 8 1.27,-3.81; 9 3.81,-6.35; 10 3.81,-3.81; 11 6.35,-6.35; 12 6.35,-3.81
PQFN_5X6_E = smd 1.5 x 0.6: 1 -3.02,1.905; 2 -3.02,0.635; 3 -3.02,-0.635; 4 -3.02,-1.905 | smd 4.895 x 4.41: 5678 1.323,0
R2512 = smd 1.8 x 3.2: 1 -2.8,0; 2 2.8,0
R0603 = smd 1 x 1.1: 1 -0.85,0; 2 0.85,0
34EWMSP12M6RT = smd 3.81 x 2.03: 1 -3.685,0; 3 3.685,0 | smd 1.02 x 2.03: 2 0,0 | smd 2.03 x 2.03: LEG1 -1.78,7.62; LEG3 1.78,7.62
P1-13 = drill 1.321 pad 2.159 octagon: TP 0,0
TSSOP-48_PAD = smd 0.3 x 1.55: 1 -5.75,-3.75; 2 -5.25,-3.75; 3 -4.75,-3.75; 4 -4.25,-3.75; 5 -3.75,-3.75; 6 -3.25,-3.75; 7 -2.75,-3.75; 8 -2.25,-3.75; 9 -1.75,-3.75; 10 -1.25,-3.75; 11 -0.75,-3.75; 12 -0.25,-3.75; 13 0.25,-3.75; 14 0.75,-3.75; 15 1.25,-3.75; 16 1.75,-3.75; 17 2.25,-3.75; 18 2.75,-3.75; 19 3.25,-3.75; 20 3.75,-3.75; 21 4.25,-3.75; 22 4.75,-3.75; 23 5.25,-3.75; 24 5.75,-3.75; 25 5.75,3.75; 26 5.25,3.75; 27 4.75,3.75; 28 4.25,3.75; 29 3.75,3.75; 30 3.25,3.75; 31 2.75,3.75; 32 2.25,3.75; 33 1.75,3.75; 34 1.25,3.75; 35 0.75,3.75; 36 0.25,3.75; 37 -0.25,3.75; 38 -0.75,3.75; 39 -1.25,3.75; 40 -1.75,3.75; 41 -2.25,3.75; 42 -2.75,3.75; 43 -3.25,3.75; 44 -3.75,3.75; 45 -4.25,3.75; 46 -4.75,3.75; 47 -5.25,3.75; 48 -5.75,3.75 | smd 4.42 x 3.483: PAD 0,0
PW0008A_N = smd 1.4 x 0.45: 1 -2.95,0.975; 2 -2.95,0.325; 3 -2.95,-0.325; 4 -2.95,-0.975; 5 2.95,-0.975; 6 2.95,-0.325; 7 2.95,0.325; 8 2.95,0.975
RTJ20_2P7X2P7 = smd 0.85 x 0.28: 1 -1.975,1; 2 -1.975,0.5; 3 -1.975,0; 4 -1.975,-0.5; 5 -1.975,-1; 11 1.975,-1; 12 1.975,-0.5; 13 1.975,0; 14 1.975,0.5; 15 1.975,1 | smd 0.28 x 0.85: 6 -1,-1.975; 7 -0.5,-1.975; 8 0,-1.975; 9 0.5,-1.975; 10 1,-1.975; 16 1,1.975; 17 0.5,1.975; 18 0,1.975; 19 -0.5,1.975; 20 -1,1.975 | smd 2.7 x 2.7: 21 0,0
MPM3620GQV-P = smd 0.7 x 0.25: 1 -1.45,1.55; 12 1.45,1.55 | smd 1.1 x 0.25: 2 -1.25,0.9; 3 -1.25,0.25; 10 1.25,0.25; 11 1.25,0.9 | smd 0.25 x 0.7: 13 1.25,2.45; 14 0.75,2.45; 17 -0.75,2.45; 18 -1.25,2.45 | smd 0.25 x 1.1: 15 0.25,2.25; 16 -0.25,2.25 | smd 0.6 x 1.95: 456 -1,-1.25; 789 1,-1.25
POWERSO-16 = smd 0.5 x 2: 1 -2.8,-6; 2 -2,-6; 3 -1.2,-6; 4 -0.4,-6; 5 0.4,-6; 6 1.2,-6; 7 2,-6; 8 2.8,-6; 9 2.8,6; 10 2,6; 11 1.2,6; 12 0.4,6; 13 -0.4,6; 14 -1.2,6; 15 -2,6; 16 -2.8,6 | smd 10.5 x 7.4: 17 0,0
SOT-23-5 = smd 0.6 x 1.2: 1 -0.95,-1.306; 2 0,-1.306; 3 0.95,-1.306; 4 0.95,1.306; 5 -0.95,1.306
3557-2 = drill 1.75: 1 -6.735,1.7; 2 -6.735,-1.7; 3 6.735,-1.7; 4 6.735,1.7

### Placement (x,y rotation side)
C1  58,19 270 bottom
C2  51.5,19 270 bottom
C3  45,19 270 bottom
C4  57.75,33.5 270 top
C5  51.25,33.5 270 top
C6  44.75,33.5 270 top
C7  42.38,46 270 bottom
C8  44.5,46 270 bottom
C9  49.25,51.75 180 top
C10  56,42.5 90 top
C11  52.5,47 180 bottom
C12  63.07,41.2 90 top
C13  34.95,45.63 90 top
C14  18.75,60.5 270 top
C15  18.75,76.5 90 top
C16  41.75,60.5 270 top
C17  41.75,76.5 90 top
C18  53.25,60.5 270 top
C19  53.25,76.5 90 top
C20  21.25,60.5 270 top
C21  21.25,76.5 90 top
C22  52,25.5 90 bottom
C23  45.5,25.5 90 bottom
C24  39,25.5 90 bottom
C25  66,18.88 0 top
C27  66,21 0 top
C29  67.5,26.62 0 top
C41  3.5,54.75 90 top
C42  66,14.62 0 top
C44  13,54.5 0 top
C45  66,16.75 0 top
C49  19.5,49 270 top
D1  2.25,69.5 90 top
D4  2.25,60.5 90 top
D5  2.25,63.5 90 top
D7  2.25,66.5 90 top
F1  13,52 0 top
IC1  14.25,68.5 180 top
IC2  25.75,68.5 0 top
IC3  37.25,68.5 180 top
IC4  48.75,68.5 180 top
J1  61.86,9.43 0 top
J2  42.21,9.39 0 top
J3  18.25,9.58 0 top
J6  19.05,24.75 90 top
JP1  20,87.5 0 top
JP2  43,87.5 0 top
Q1  54.5,33.5 90 bottom
Q2  54.5,33.5 270 top
Q3  48,33.5 90 bottom
Q4  48,33.5 270 top
Q5  41.5,33.5 90 bottom
Q6  41.5,33.5 270 top
R1  48.5,24 270 top
R2  55,24 270 top
R3  42,24 270 top
R4  52.5,44.88 0 bottom
R5  52,22.25 90 bottom
R6  45.5,22.25 90 bottom
R7  39,22.25 90 bottom
R8  43,51.75 180 top
R9  5.25,69.5 0 top
R13  14.12,35 0 top
R14  11.5,36 270 top
R15  3,49.75 0 top
R16  3,52 0 top
R17  18.5,40 0 bottom
R18  18.5,42.12 0 bottom
R19  18.5,37.88 0 bottom
R20  9.25,50.5 0 top
R21  6.5,49.75 90 top
R22  5.25,60.5 0 top
R23  5.25,63.5 180 top
R24  24.5,49 90 top
R25  5.25,66.5 0 top
S3  9,41.5 90 top
TP1  51.75,15.5 0 top
TP2  45.3,15.47 0 top
TP3  38.75,15.5 0 top
U1  48,45.5 180 top
U2  55,21 270 bottom
U3  48.49,21.05 270 bottom
U4  42,21 270 bottom
U6  61.5,26.5 0 top
U7  8,54 90 top
U8  21,40 90 top
U9  59.5,17 90 top
U13  22,49 0 top
XF1  33.11,24.85 90 top

### Tracks (layer width: path | path; a pad name or v marks a point on that pad's centre or on a via)
3.3V-EN
  Top 0.3: U13.3 24.04,47.69 R24.1
3V3-LED
  Top 0.3: D7.A R25.1
5V-LED
  Top 0.3: D5.A R23.2
18.5V-LED
  Top 0.3: D4.A R22.1
+3V3  (via drill 0.35)  (6 unrouted)
  Top 0.3: R8.2 42.15,50.85 v42.25,50.75 44,50.75 44.25,50.5 U1.20 | C10.1 56,41.5 v55.02,40.52 52.52,40.52 52.25,40.8 U1.45 | R25.2 v7.5,66.5 | IC1.16 18.75,63.84 C14.1 19.85,61.35 v20,61.5 20.15,61.35 C20.1 21.3,61.41 IC2.1 | IC1.10 11.07,62.42 v11.25,62.25 | v43,61.5 42.85,61.35 C16.1 41.7,61.41 IC3.16 | IC4.10 45.58,62.42 v45.75,62.25 | v54.5,61.5 54.35,61.35 C18.1 53.2,61.41 IC4.16 | IC3.10 34.08,62.42 v34.25,62.25 | IC2.7 28.93,62.42 v28.75,62.25
  Top 0.5: U13.5 19.96,50.31 C49.1 v19.5,51
  Power 0.5: v7.5,66.5 11.25,62.75 v11.25,62.25 12,61.5 v20,61.5 28.75,61.5 | 28.75,61.5 31.5,61.5 | 31.5,61.5 34.25,61.5 | 34.25,61.5 v43,61.5 45.75,61.5 | 45.75,61.5 v54.5,61.5 | v45.75,62.25 45.75,61.5 | v34.25,62.25 34.25,61.5 | v28.75,62.25 28.75,61.5 | v19.5,51 21.5,49 31.5,49 | 31.5,49 40.5,49 v42.25,50.75 53.25,50.75 56,48 56,45 | 56,45 56,41.5 v55.02,40.52 | 31.5,61.5 31.5,49 | v54.5,45 56,45
  Bottom 0.3: v54.5,45 54.38,44.88 R4.1 | U2.5 57.9,18.05 C1.2 | 49.14,18.43 U3.5 51.45,18.1 C2.2 | U4.5 44.9,18.05 C3.2
+5V  (via drill 0.35)  (1 unrouted)
  Top 0.3: R23.1 v7.5,63.5
  Top 0.5: U13.1 21.05,48.55 21.5,49 23.65,49 R24.2 v24.5,51
  Power 0.152: 41,13.35 40.96,13.39
  Power 0.3: 13.5,52.5 v15.25,52.5
  Power 0.5: v7.5,63.5 7.5,62 9,60.5 9,57 13.5,52.5 | v24.5,51 22,51 20.5,52.5 v15.25,52.5 v15.25,51.5 15.25,14.25 17.5,12 19.25,12 | 19.25,12 41,12 | 41,12 60,12 62.29,12 J1.4 | J3.5 19.25,12 | J2.4 40.96,11.96 41,12 | 40.96,13.39 40.73,13.62 v40.5,13.62 40,13.62 39.88,13.75 v38.75,13.75 v37.25,13.75 | 41,12 41,13.35
  pour Top (no thermals): 13.5,53 13.5,51 15.75,51 15.75,53
+5V-FUSE
  pour Top (no thermals): 8.25,56 8.25,54.75 10.25,54.75 11,54 11,51.75 10.75,51.5 9.5,51.5 9.5,50 12,50 12.5,50.5 12.75,50.75 12.75,53.75 12.75,55.75 12.5,56
+18.5V  (via drill 0.35)  (24 unrouted)
  Top 0.3: U7.16 3.65,53.75 C41.1 | U1.25 36.07,41.75 C13.1 | C42.1 66.5,13.28 v66.5,12.12 | C41.1 2.85,53.25 v2.5,53.25 | C41.1 3.4,54 v2.5,54 | R22.2 v7.5,60.5
  Top 0.5: C42.1 62.77,17 U9.2
  other vias: 31,39 32,39 33,39 34,39 35,39 31,38 32,38 33,38 34,38 35,38 31,37 32,37 33,37 34,37 35,37
  pour Top (no thermals): 30,30.5 30.5,30 36,30 36.5,30.5 36.5,41.5 36,42 30.5,42 30,41.5
  pour Bottom (no thermals): 39.5,32.5 39,32.5 36.5,35 30,35 30,41.5 30.5,42 36,42 36.5,41.5 36.5,40 39.5,37 56.5,37 61.5,37 62,37.5 64.5,37.5 64.5,35.5 61.5,32.5 56.5,32.5
  pour Top (no thermals): 2,54.5 2,53 4,53 4.75,53.75 4,54.5
  pour Power (no thermals): 0,67.5 0,0 70.5,0 70.5,67.5
A_H
  Top 0.3: U1.13 47.75,50.75 47.5,51 47.5,54.5 50.66,57.66 IC4.14
A_L
  Top 0.3: U1.14 47.25,50.61 47.05,50.81 47.05,54.69 49.38,57.02 IC4.13
AAM
  Top 0.3: U7.18 5.55,51.45 R15.2
ADC_3V3  (via drill 0.35)
  Top 0.152: 66.65,29.35 v66.5,29.5 | U6.17 62.02,28.5 | U9.3 60.86,18 | 62.5,29
  Top 0.3: C29.1 66.65,22.5 C27.1 63.52,21 61,23.52 U6.7 61,22.02 64.15,18.88 C25.1 | U6.10 62.5,24.18 63.35,23.32 C29.1 | U6.16 62.5,28.5 62.02,28.5 | U6.16 | C29.1 66.65,29.35 | U6.16 62.5,29 v63,29.5
  Top 0.5: C25.1 C45.1 63.9,18 62.5,18 60.86,18
  Bottom 0.3: v63,29.5 v66.5,29.5
AVDD  (via drill 0.35)
  Top 0.3: U1.23 v42.75,48
  Bottom 0.3: v42.75,48 42.75,47.23 C7.1
B_H
  Top 0.3: U1.15 46.75,50.48 46.6,50.63 46.6,54.87 48.12,56.39 IC4.12
B_L
  Top 0.3: U1.16 46.25,50.34 46.15,50.44 46.15,55.15 46.84,55.84 IC4.11
BST_A
  Top 0.3: C4.1 57.75,39.25 57.1,39.9 52.51,39.9 51.75,40.66 U1.44
BST_B
  Top 0.3: U1.39 49.25,40.61 50.93,38.93 50.93,34.67 C5.1
BST_C
  Top 0.3: U1.34 46.75,40.39 45.49,39.13 45.49,35.09 C6.1
C_H
  Top 0.3: U1.17 45.75,50.2 45.7,50.25 45.7,55.3 45,56 40.5,56 39.16,57.34 IC3.14
C_L
  Top 0.3: U1.18 45.25,55.11 44.81,55.55 40.31,55.55 37.88,57.98 IC3.13
CP1
  Top 0.3: U1.10 49.25,50.9 C9.1
CP2
  Top 0.3: U1.11 48.75,51.4 C9.2
CS1  (via drill 0.35)
  Top 0.3: U8.10 v16.5,42
  Bottom 0.3: R18.2 16.62,42.12 v16.5,42
CS2  (via drill 0.35)
  Top 0.3: U8.15 v16.5,38
  Bottom 0.3: R19.2 16.62,37.88 v16.5,38
CS-DIS  (via drill 0.35)
  Top 0.3: U8.12 16.1,40.4 v16.5,40
  Bottom 0.3: v16.5,40 R17.2
CS_ADC  (via drill 0.35)
  Top 0.3: IC1.14 16.16,59.84 v16.5,59.5 | U6.11 64.47,25.5 65.47,26.5 65.5,26.5 65.5,32 v66.5,33
  Bottom 0.3: v16.5,59.5 18.5,57.5 52.5,57.5 67,43 67,33.5 v66.5,33
CS_MOTOR  (via drill 0.35)
  Top 0.3: IC2.6 27.66,57.09 v28,56.75 | U1.4 52.25,50.34 52.35,50.44 52.35,56.4 v52,56.75
  Bottom 0.3: v28,56.75 v52,56.75
DVDD  (via drill 0.35)
  Top 0.3: R8.1 44.75,50.85 U1.19 v44.75,48
  Bottom 0.3: C8.1 44.75,47.1 v44.75,48
EN
  Top 0.3: R16.2 5.1,53.25 U7.17
EN-PWR
  Top 0.3: S3.2 9.25,41.25 | 9.25,41.25 13.3,37.2 U8.16 | U8.9 10.8,42.8 | 10.8,42.8 9.25,41.25 | R16.1 1,50.85 1,48.5 1.5,48 10.5,48 10.8,47.7 10.8,42.8
EN-PWR-PRE
  Top 0.3: R13.1 11.65,35 R14.2 10.85,35.15 9,37 S3.1
EN_GATE  (via drill 0.35)
  Top 0.3: U1.12 v48.25,48
  Bottom 0.3: v48.25,48 49,47.25 50.25,47.25 50.25,46.27 R4.2
ENC_A  (via drill 0.35)
  Top 0.3: IC3.12 36.62,59.38 v37,59
  Bottom 0.3: v37,59 52.27,59 68,43.27 68,16.57 J1.2
ENC_B  (via drill 0.35)
  Top 0.3: IC3.11 35.34,58.41 v35.5,58.25
  Bottom 0.3: v35.5,58.25 52.39,58.25 67.5,43.14 67.5,18.07 J1.1
FB
  Top 0.3: R20.1 6.6,50.5 6.55,50.55 R21.2 6.45,50.65 U7.1
FPGA_A_H
  Top 0.3: IC4.3 50.66,82.39 JP2.12
FPGA_A_L
  Top 0.3: IC4.4 49.38,81.11 JP2.11
FPGA_B_H
  Top 0.3: IC4.5 48.12,82.39 JP2.10
FPGA_B_L
  Top 0.3: IC4.6 46.84,81.11 JP2.9
FPGA_C_H
  Top 0.3: IC3.3 39.16,77.16 40.5,78.5 45,78.5 45.5,79 45.5,83 44.81,83.69 JP2.8
FPGA_C_L
  Top 0.3: IC3.4 37.88,76.89 40,79 43.5,79 44.27,79.77 JP2.7
FPGA_CS_ADC
  Top 0.3: IC1.3 16.16,77.16 17.5,78.5 22,78.5 22.5,79 22.5,83 21.81,83.69 JP1.8
FPGA_CS_MOTOR
  Top 0.3: IC2.11 27.66,82.39 JP1.12
FPGA_ENC_A
  Top 0.3: IC3.5 36.62,76.61 39.5,79.5 42.5,79.5 43,80 43,83 42.31,83.69 JP2.6
FPGA_ENC_B
  Top 0.3: IC3.6 35.34,76.84 38.5,80 41.5,80 41.73,80.23 JP2.5
FPGA_GND  (via drill 0.35)
  Top 0.3: IC1.2 17.43,76.03 C15.2 19.85,77.35 v20,77.5 20.15,77.35 C21.2 22.57,76.03 IC2.15 | IC3.2 40.42,76.03 C17.2 42.65,77.35 v42.75,77.25 | IC4.2 51.92,76.03 C19.2 54.15,77.35 v54.25,77.25 | D1.C v1.5,70.5 | IC1.8 9.8,74.69 v9.75,74.75 | IC2.9 30.2,74.69 v30.25,74.75 | IC3.8 32.8,74.69 v32.75,74.75 | IC4.8 44.3,74.69 v44.25,74.75
  pour GND (no thermals): 0,94.38 0,69.5 70.5,69.5 70.5,94.38
FPGA_H1
  Top 0.3: IC2.14 23.84,81.11 JP1.9
FPGA_H2
  Top 0.3: IC2.13 25.11,82.39 JP1.10
FPGA_H3
  Top 0.3: IC2.12 26.39,81.11 JP1.11
FPGA_MISO
  Top 0.3: IC1.6 12.35,76.34 16,80 18.5,80 18.73,80.23 JP1.5
FPGA_MOSI
  Top 0.3: IC1.5 13.62,76.61 16.5,79.5 19.5,79.5 20,80 20,83 19.31,83.69 JP1.6
FPGA_SCK
  Top 0.3: IC1.4 14.88,76.89 17,79 20.5,79 21.27,79.77 JP1.7
FPGA_VCC  (via drill 0.35)
  Top 0.3: IC1.1 18.7,75.59 C15.1 19.85,75.65 v20,75.5 20.15,75.65 C21.1 21.3,75.59 IC2.16 | IC3.1 41.75,73.16 C17.1 42.65,75.65 v42.75,75.75 | IC4.1 53.2,75.59 C19.1 54.15,75.65 v54.25,75.75 | R9.2 6,69.6 v6,71 | IC1.7 11.07,74.58 v11.25,74.75 | IC2.10 28.93,74.58 v28.75,74.75 | IC3.7 34.08,74.58 v34.25,74.75
  pour Power (no thermals): 0,94.12 0,69.5 70.5,69.5 70.5,94.12
GH_A  (via drill 0.35)
  Top 0.3: v52.5,39 52.28,39.22 52.28,39.49 51.25,40.52 U1.43
  Power 0.3: v52.5,39 51.75,38.25 v51.75,30
  Bottom 0.3: v51.75,30 52.12,30 Q1.4
GH_B  (via drill 0.35)
  Top 0.3: U1.38 48.75,40 v49,39.75
  Power 0.3: v49,39.75 48.65,39.4 48,39.4 45.55,36.95 45.55,30.7 45.03,30.18 v45.03,29.97
  Bottom 0.3: v45.03,29.97 45.59,29.97 Q3.4
GH_C  (via drill 0.35)
  Top 0.3: U1.33 46.25,40.52 44.73,39 v44.5,39
  Power 0.3: v44.5,39 44,39.5 40.5,39.5 38.5,37.5 v38.5,30.5
  Bottom 0.3: v38.5,30.5 39.58,30.5 Q5.4
GL_A
  Top 0.3: U1.41 50.25,40.5 50.25,40.25 51.38,39.12 51.38,37.73 Q2.4
GL_B
  Top 0.3: U1.36 47.75,40.75 46.09,39.09 Q4.4
GL_C
  Top 0.3: Q6.4 39.59,39.09 40.5,40 43.65,40 44.25,40.6 45.05,40.6 45.25,40.8 U1.31
GND  (via drill 0.35)  (77 unrouted)
  Top 0.152: v62,23.52 v62.01,23.51
  Top 0.3: U6.6 60.5,25.32 62.5,27 | U6.1 v59,27.5 v59,26 | U6.3 59.27,26.75 U6.2 59,26.48 v59,24.5 | v59,26 U6.4 U6.5 59.62,25.5 61.46,27.04 | IC1.15 17.43,60.98 C14.2 19.85,59.65 v20,59.5 20.15,59.65 C20.2 22.57,60.98 IC2.2 | IC4.15 51.92,60.98 C18.2 54.35,59.65 v54.5,59.5 | IC3.15 40.42,60.98 C16.2 42,59.9 42.85,59.9 v43,59.75 | U8.13 13.1,39.6 v13,39.5 | R14.1 11,37.35 v11,38 | U7.3 7.75,52.25 v7.25,51.75 | R15.1 3,48.9 v5,48.9 R21.1 | U1.PAD v49,45.5 | U1.PAD 47.5,46 v47.5,46.5 | U1.PAD 48,46 v48.5,46.5 | U1.PAD 47,46.5 v46.5,46.5 | U1.PAD 49,46.5 v49.5,46.5 | 47.5,45.5 v46.5,44.5 | U1.PAD 47.5,45 v47.5,44.5 | U1.PAD 48,45 v48.5,44.5 | U1.PAD 49,44.5 v49.5,44.5 | U1.24 42.25,48.35 42.15,48.25 42.15,47.75 44.4,45.5 44.5,45.5 | 44.5,45.5 47.5,45.5 | 47.5,45.5 U1.PAD | v44.5,44.25 44.5,45.5 | U1.30 44.75,43.25 v47,45.5 | U1.35 47.25,44.75 U1.PAD | U1.40 49.75,43.75 U1.PAD | C10.2 55.35,44 49.5,44 U1.PAD | U1.3 52.75,47.25 52,46.5 | 52,46.5 51,45.5 U1.PAD | C29.2 69.25,27.52 v69.25,28 | v59,26 v59,24.5 | v59,24.5 v59,22 | D7.C D5.C D4.C v1.5,59.5 | IC1.9 9.8,62.3 v9.75,62.25 | IC2.8 30.2,62.3 v30.25,62.25 | IC4.9 44.3,62.3 v44.25,62.25 | IC3.9 32.8,62.3 v32.75,62.25 | U1.8 50.3,49.2 50.3,48.35 52,46.65 52,46.5 | U6.9 v62,23.52
  Top 0.5: C45.2 C25.2 C27.2 68.35,22.5 C29.2 | U13.2 v22,46.5 | C49.2 v19.5,47 | U9.1 62.45,16.05 v63,15.5
  Bottom 0.3: U4.7 41.67,19.18 42.35,19.85 43.65,19.85 | 43.65,19.85 C3.1 45,20 v44.25,20.75 | U4.4 42.98,23 | 42.98,23 42.98,20.52 43.65,19.85 | U3.7 48.16,19.16 48.85,19.85 50.15,19.85 | 50.15,19.85 C2.1 51.5,20 v50.75,20.75 | U2.7 54.67,19.18 55.35,19.85 56.5,19.85 | 56.5,19.85 C1.1 58,20 v57.25,20.75 | U3.4 49.5,23.96 49.5,23 | 49.5,23 49.5,20.5 50.15,19.85 | U2.4 56,23.93 56,22.5 | 56.5,19.85 56,20.35 56,22.5 | R18.1 R17.1 19.35,39 | 19.35,39 R19.1 | v13,39.5 13.5,39 19.35,39 | C7.2 C8.2 v44.5,44.25 | C11.2 v54.5,47 | 42.98,23 v44,23 | 49.5,23 v50.5,23 | 56,22.5 v57,22.5 | C24.2 v39,27.5 | C23.2 v45.5,27.5 | C22.2 v52,27.5
  other vias: 43,37.75 41,37.75 41.5,38.5 42,37.75 42.5,38.5 47.5,37.75 48,38.5 48.5,37.75 49,38.5 49.5,37.75 54,37.75 54.5,38.5 55,37.75 55.5,38.5 56,37.75 3.5,46.5 2.5,46.5 4.5,46.5 5.5,46.5 48,45.5 15.25,55 15.25,54 5.5,56.75 4.5,56.75 3.5,56.75
  pour Top (no thermals): 40.5,39 40.5,36 43.5,36 43.5,39
  pour Top (no thermals): 47,39 47,36 50,36 50,39
  pour Top (no thermals): 53.5,39 53.5,36 56.5,36 56.5,39
  pour GND (no thermals): 0,67.5 70.5,67.5 70.5,0 0,0
  pour Top (no thermals): 0.25,38.75 0.25,47.25 10,47.25 10,43.25 2.75,43.25 2.75,38.75
  pour Top (no thermals): 43.25,47.25 53.25,47.25 53.25,43.75 43.25,43.75
  pour Top: 54,41 52.75,41 52.75,43.25 51.75,44.25 53.25,44.25 54,43.5
  pour Top (no thermals): 6.5,54.75 4.5,54.75 4.25,55 2,55 2,57.5 6.5,57.5
  pour Top (no thermals): 13.5,55.5 13.5,53.5 15.75,53.5 15.75,55.5
GVDD  (via drill 0.35)
  Top 0.3: U1.9 v49.75,48
  Bottom 0.3: C11.1 50.65,48 v49.75,48
H1  (via drill 0.35)
  Top 0.3: v23.5,52 23.84,52.34 IC2.3
  Bottom 0.3: J2.1 32.07,8 16.83,8 J3.3 15.25,30.75 10,36 10,40 18,48 18,51.5 18.5,52 v23.5,52
H2  (via drill 0.35)
  Top 0.3: v24.75,52.75 25.11,53.12 IC2.4
  Bottom 0.3: J2.3 36.07,7 15.83,7 J3.2 13.25,32.11 9.55,35.81 9.55,40.19 17.55,48.19 17.55,51.69 18.61,52.75 v24.75,52.75
H3  (via drill 0.35)
  Top 0.3: v26,53.5 26.39,53.88 IC2.5
  Bottom 0.3: J2.5 40.07,6 14.83,6 J3.1 11.25,33.48 9.1,35.63 9.1,40.37 17.1,48.37 17.1,51.87 18.73,53.5 v26,53.5
MISO  (via drill 0.35)  (1 unrouted)
  Top 0.3: IC1.11 12.35,60.66 v12.5,60.5 | U1.6 51.25,50.61 51.45,50.81 51.45,54.8 v51,55.25 | v64.5,33 64.47,32.98 64.47,27.5 | 64.5,27.5 64,27 U6.14
  Bottom 0.3: v12.5,60.5 17.75,55.25 v51,55.25 53.39,55.25 66,42.64 66,34.5 v64.5,33
MOSI  (via drill 0.35)
  Top 0.3: IC1.12 13.62,60.38 v14,60 | U1.5 51.75,50.48 51.9,50.63 51.9,55.6 v51.5,56 | U6.13 64.47,26.5 65,27.02 65,32.5 v65.5,33
  Bottom 0.3: v14,60 18,56 v51.5,56 53.27,56 66.5,42.77 66.5,34 v65.5,33
N$1
  Top 0.3: D1.A R9.1
OUT_A
  Bottom 0.3: TP1.TP 51.75,15.78 U2.8 53,19.07 53,20.5 52.1,21.4 R5.1
OUT_B
  Bottom 0.3: TP2.TP 45.3,15.88 U3.8 46.5,19.12 46.5,20.5 45.6,21.4 R6.1
OUT_C
  Bottom 0.3: TP3.TP 38.75,15.78 U4.8 40,19.07 40,20.5 39.1,21.4 R7.1
PHASE_A  (via drill 0.35)
  Top 0.3: v55,22.5 R2.2
  Bottom 0.3: U2.3 55.33,22.82 v55,22.5
  pour Top (no thermals): 53.5,22 53.5,14 50,10.5 50,8.5 52,8.5 52,10.5 56.5,15 56.5,22
  pour Top (no thermals): 24.5,8 24.5,10.5 26,10.5 26,8.5 27,7.5 49.5,7.5 50,8 50,10.5 52,10.5 52,8 50.25,6.25 26.25,6.25
PHASE_B  (via drill 0.35)
  Top 0.3: v48.5,22.5 R1.2
  Bottom 0.3: U3.3 48.81,22.82 v48.5,22.5
  pour Top (no thermals): 47,22 47,11.5 47.5,11 47.5,8.5 49.5,8.5 49.5,11 50,11.5 50,22
  pour Bottom (no thermals): 22.5,11 22.5,8.75 24,8.75 24,10.5 24.5,11 47,11 47.5,10.5 47.5,8.5 49.5,8.5 49.5,11 48,12.5 24,12.5
PHASE_C  (via drill 0.35)
  Top 0.3: v42,22.5 R3.2
  Bottom 0.3: U4.3 42.33,22.82 v42,22.5
  pour Top (no thermals): 43.5,22 43.5,14 47,10.5 47,8.5 45,8.5 45,10.5 40.5,15 40.5,22
  pour Top (no thermals): 20.5,11 20.5,8.75 22,8.75 22,10.5 22.5,11 46.5,11 45,12.5 22,12.5
SCK  (via drill 0.35)
  Top 0.3: IC1.13 14.88,57.12 v15,57 | U1.7 50.8,49.3 50.75,49.35 50.75,50.75 51,51 51,54 v50.5,54.5 | v63.5,33 63.98,32.52 63.98,28 U6.15
  Bottom 0.3: v15,57 17.5,54.5 v50.5,54.5 53.5,54.5 65.5,42.5 65.5,35 v63.5,33
SENSE_A  (via drill 0.35)
  Top 0.3: 58,27.48 58,28.48 58.02,28.48 57.99,28.51 59,29.48 60,29.48 60.5,28.98 U6.20 | 58,27.48 58,24.02 57.52,23.55 54,23.51 53.51,23.51 v53,23 | 58,27.48
  Bottom 0.3: C22.1 R5.2 52.2,23.1 52.5,23 v53,23
SENSE_B  (via drill 0.35)
  Top 0.3: U6.19 61,29.37 60,30.37 58.86,30.37 57.39,28.89 57.39,24.39 57,24 v46.5,24
  Bottom 0.3: R6.2 45.5,24 | 45.5,24 C23.1 | 45.5,24 v46.5,24
SENSE_C  (via drill 0.35)
  Top 0.152: 40.23,24.98 v40,24.75
  Top 0.3: U6.18 61.5,29.86 60.39,30.97 58.47,30.97 v57.83,30.33 | v56.79,25 55.79,25 55.29,24.5 54.5,24.5 54,25 49.5,25 49,24.5 48,24.5 47.5,25 43,25 42.5,24.5 | 42,24.5 42.02,24.52 42.48,24.52 42.5,24.5 | 42.5,24.5 41.5,24.5 41,25 40.23,24.98
  Bottom 0.3: R7.2 C24.1 39.9,24.65 v40,24.75 | v57.83,30.33 57.83,25.33 57.5,25 v56.79,25
SH_A  (via drill 0.35)
  Top 0.3: v55,25.5 R2.1 | C4.2 57.6,32.5 54.82,32.5 Q2.5678 55.18,31.5 v57.5,31.5 | U1.42 50.75,40.39 51.83,39.3 51.83,38.67 v52.5,38
  Power 0.3: v52.5,38 54,39.5 56,39.5 57.5,38 v57.5,31.5
  Bottom 0.3: U2.2 54.67,25.18 v55,25.5
  other vias: 54,29.25 54.5,28.5 55,29.25 55.5,28.5 56,29.25
  pour Top (no thermals): 53.5,31.5 53.5,27 56.5,27 56.5,31.5
  pour Bottom (no thermals): 53.5,31.5 53.5,28 56.5,28 56.5,31.5
SH_B  (via drill 0.35)
  Top 0.3: v48.5,25.5 R1.1 | C5.2 48.65,32.65 48.25,32.25 | Q4.5678 48.18,32.18 48.25,32.25 | U1.37 48.25,40.25 v48,40 | v51,30.5 50,30.5 48.25,32.25
  Power 0.3: v48,40 48.5,40.5 49.5,40.5 51,39 v51,30.5
  Bottom 0.3: U3.2 48.16,25.16 v48.5,25.5
  other vias: 47.5,29.25 48,28.5 49.5,29.25 48.5,29.25 49,28.5
  pour Bottom (no thermals): 47,31.5 47,28 50,28 50,31.5
  pour Top (no thermals): 47,31.5 47,27.5 50,27.5 50,31.5
SH_C  (via drill 0.35)
  Top 0.3: v42,25.5 R3.1 | C6.2 44.6,32.5 41.82,32.5 Q6.5678 43.18,30.5 v44.5,30.5 | U1.32 45.75,40.66 45.09,40 v44.5,40
  Power 0.3: v44.5,40 45.1,39.4 45.1,31.1 v44.5,30.5
  Bottom 0.3: U4.2 41.67,25.18 v42,25.5
  other vias: 41,29.25 41.5,28.5 42,29.25 42.5,28.5 43,29.25
  pour Top (no thermals): 40.5,31.5 40.5,27 43.5,27 43.5,31.5
  pour Bottom (no thermals): 40.5,31.5 40.5,28 43.5,28 43.5,31.5
VBATT
  pour Top (no thermals): 26,43 26,17 26.5,16.5 36,16.5 36.5,17 36.5,19.5 36,20 29.5,20 29,20.5 29,42.5 28.5,43
VIN
  Top 0.3: R13.2 18.5,35 21,37.5 U8.17
  pour Top (no thermals): 17.5,45 17.5,27 24.5,27 24.5,45